# Altium project nPOC-BB_beta_main-board.PrjPcb (part 2 of 4)

## Sheet Battery and Charging.SchDoc: Battery and Charging
size 431 x 279 mm; DrawnBy: DD; DocumentNumber: GHL-1-21002; Revision: B; SheetNumber: 4; SheetTotal: 7; ProjectID: 263-03
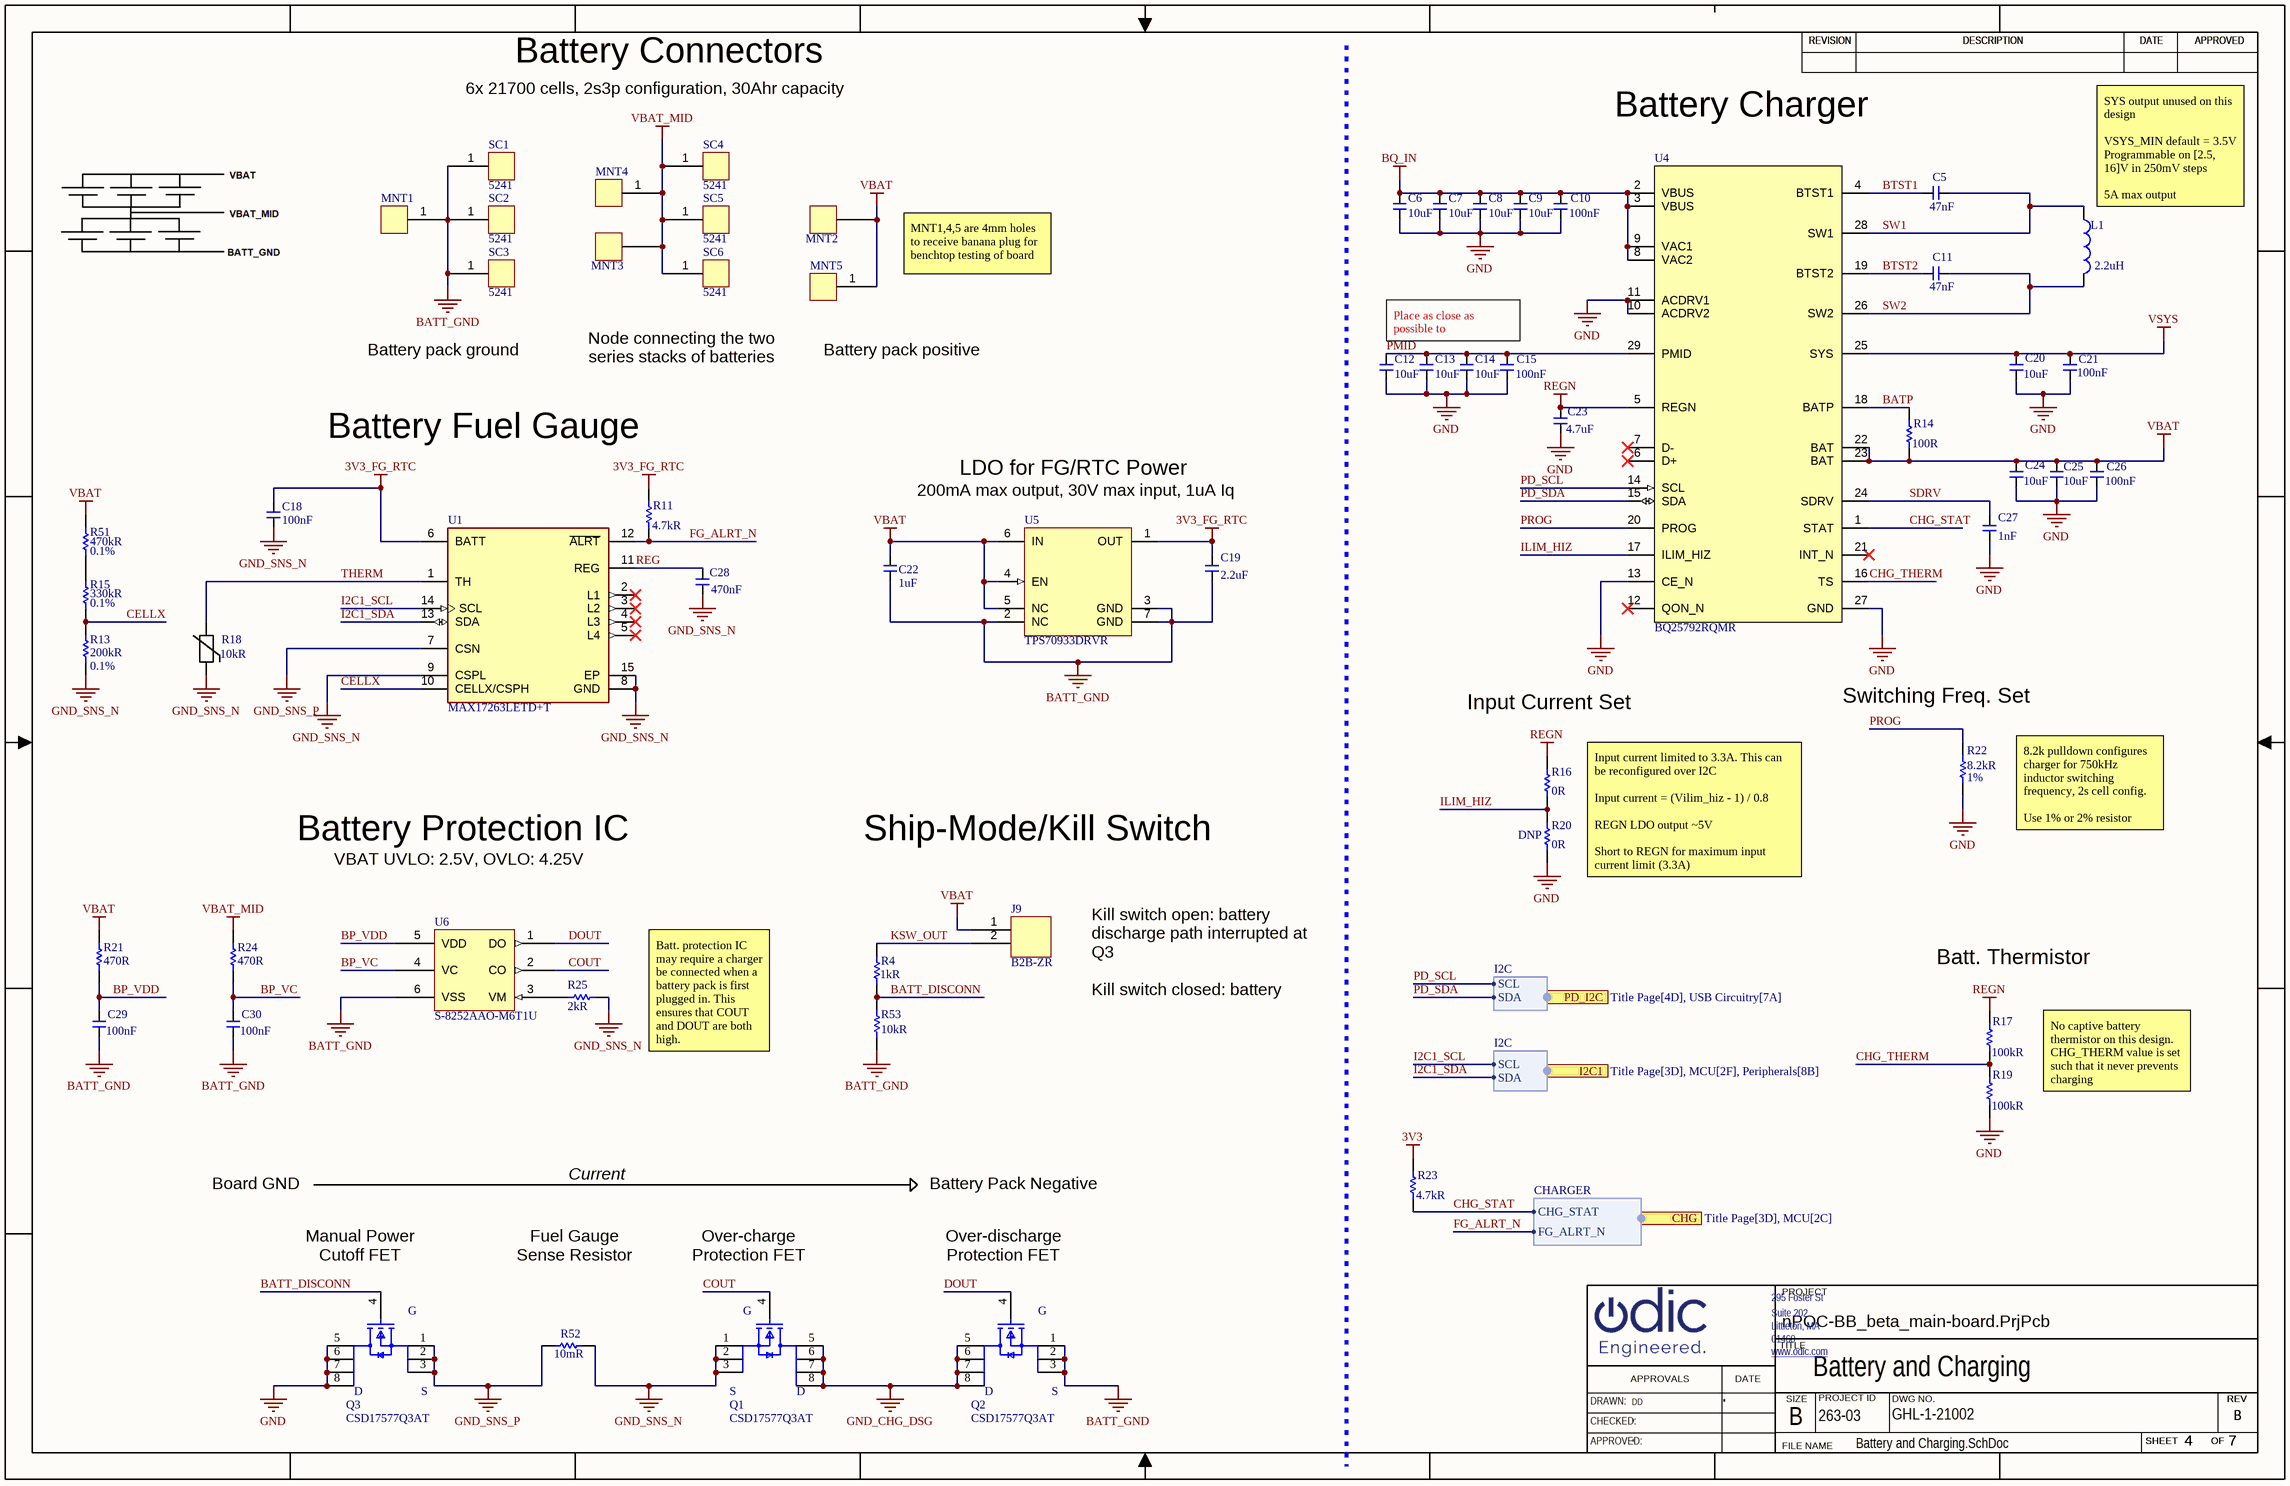
[diagram p3: Battery and Charging.SchDoc]

### Parts
C5  Capacitance: 47nF  [C0402]  (hidden comment: C0402_47n_50V_10pct)
C6  Capacitance: 10uF  [C0603]  (hidden comment: C0603_10u_25V_10pct)
C7  Capacitance: 10uF  [C0603]  (hidden comment: C0603_10u_25V_10pct)
C8  Capacitance: 10uF  [C0603]  (hidden comment: C0603_10u_25V_10pct)
C9  Capacitance: 10uF  [C0603]  (hidden comment: C0603_10u_25V_10pct)
C10  Capacitance: 100nF  [C0402]  (hidden comment: C0402_0u1_25V_10pct)
C11  Capacitance: 47nF  [C0402]  (hidden comment: C0402_47n_50V_10pct)
C12  Capacitance: 10uF  [C0603]  (hidden comment: C0603_10u_25V_10pct)
C13  Capacitance: 10uF  [C0603]  (hidden comment: C0603_10u_25V_10pct)
C14  Capacitance: 10uF  [C0603]  (hidden comment: C0603_10u_25V_10pct)
C15  Capacitance: 100nF  [C0402]  (hidden comment: C0402_0u1_25V_10pct)
C18  Capacitance: 100nF  [C0402]  (hidden comment: C0402_100n_16V_10pct)
C19  Capacitance: 2.2uF  [C0402]  (hidden comment: C0402_2u2_6V3_10pct)
C20  Capacitance: 10uF  [C0603]  (hidden comment: C0603_10u_25V_10pct)
C21  Capacitance: 100nF  [C0402]  (hidden comment: C0402_0u1_25V_10pct)
C22  1uF  [C0402]
C23  Capacitance: 4.7uF  [C0402]  (hidden comment: C0402_4u7_10V_20pct)
C24  Capacitance: 10uF  [C0603]  (hidden comment: C0603_10u_25V_10pct)
C25  Capacitance: 10uF  [C0603]  (hidden comment: C0603_10u_25V_10pct)
C26  Capacitance: 100nF  [C0402]  (hidden comment: C0402_0u1_25V_10pct)
C27  Capacitance: 1nF  [C0402]  (hidden comment: C0402_1n_50V_10pct)
C28  Capacitance: 470nF  [C0402]  (hidden comment: C0402_470n_6V3_10pct)
C29  value 100nF  [C0402]  (hidden comment: C0402_0u1_16V_10pct)
C30  value 100nF  [C0402]  (hidden comment: C0402_0u1_16V_10pct)
J9  B2B-ZR  [jst-b2b-zr]
L1  value 2.2uH  [ind2_5p4x5p2mm]  (hidden comment: 0530CDMCCDS-2R2MC)
MNT1  Banana Plug Hole  [conn_wire-1_4mm]  (value not drawn)
MNT2  SOLDER HOLE 10AWG  [conn_wire-1]  (value not drawn)
MNT3  SOLDER HOLE 10AWG  [conn_wire-1]  (value not drawn)
MNT4  Banana Plug Hole  [conn_wire-1_4mm]  (value not drawn)
MNT5  Banana Plug Hole  [conn_wire-1_4mm]  (value not drawn)
Q1  CSD17577Q3AT  [dfn8_3p1x3p25_p65mm]
Q2  CSD17577Q3AT  [dfn8_3p1x3p25_p65mm]
Q3  CSD17577Q3AT  [dfn8_3p1x3p25_p65mm]
R4  Resistance: 1kR  [R0402]  (hidden comment: R0402_1k0_1pct)
R11  Resistance: 4.7kR  [R0402]  (hidden comment: R0402_4k7_1pct)
R13  value 200kR  Tolerance: 0.1%  [R0402]  (hidden comment: R0402_200k_0.1pct)
R14  value 100R  [R0402]  (hidden comment: R0402_100R_1pct)
R15  value 330kR  Tolerance: 0.1%  [R0402]  (hidden comment: R0402_330k_0p1pct)
R16  Resistance: 0R  [R0402]  (hidden comment: R0402_0R)
R17  Resistance: 100kR  [R0402]  (hidden comment: R0402_100k_1pct)
R18  value 10kR  [R0603]  (hidden comment: NCU18XH103F6SRB)
R19  Resistance: 100kR  [R0402]  (hidden comment: R0402_100k_1pct)
R20  Install: DNP  Resistance: 0R  [R0402]  (hidden comment: R0402_0R)
R21  Resistance: 470R  [R0402]  (hidden comment: R0402_470R_1pct)
R22  value 8.2kR  Resistance Tolerance: 1%  [R0402]  (hidden comment: R0402_8k2_1pct)
R23  Resistance: 4.7kR  [R0402]  (hidden comment: R0402_4k7_1pct)
R24  Resistance: 470R  [R0402]  (hidden comment: R0402_470R_1pct)
R25  Resistance: 2kR  [R0402]  (hidden comment: R0402_2k_1pct)
R51  value 470kR  Tolerance: 0.1%  [R0402]  (hidden comment: R0402_470k_0p1pct)
R52  value 10mR  [R2010]  (hidden comment: R0402_10m_1pct)
R53  Resistance: 10kR  [R0402]  (hidden comment: R0402_10k_1pct)
SC1  5241  [bat_keystone-5241]
SC2  5241  [bat_keystone-5241]
SC3  5241  [bat_keystone-5241]
SC4  5241  [bat_keystone-5241]
SC5  5241  [bat_keystone-5241]
SC6  5241  [bat_keystone-5241]
U1  MAX17263LETD+T  [dfn14_3x3_p4mm]
U4  BQ25792RQMR  [qfn29_4x4_p4mm-RQM0029A]
U5  TPS70933DRVR  [dfn7_2x2_p65mm]
U6  S-8252AAO-M6T1U  [SOT23-6PIN]

### Ports
CHG (harness CHARGER, see Title Page[3D], MCU[2C]), I2C1 (harness I2C, see Title Page[3D], MCU[2F], Peripherals[8B]), PD_I2C (harness I2C, see Title Page[4D], USB Circuitry[7A])

### Harnesses
CHARGER: CHG_STAT, FG_ALRT_N
I2C: SCL, SDA

### Nets
3V3: R23.2
3V3_FG_RTC: C18.1 C19.2 R11.2 U1.6(BATT) U5.1(OUT)
BATT_GND: C19.1 C22.1 C29.1 C30.1 MNT1.1 Q2.1(S) Q2.2(S) Q2.3(S) R53.1 SC1.1 SC2.1 SC3.1 U5.2(NC) U5.3(GND) U5.7(GND) U6.6(VSS)
BQ_IN: C6.2 C7.2 C8.2 C9.2 C10.2 U4.2(VBUS) U4.3(VBUS) U4.8(VAC2) U4.9(VAC1)
GND: C6.1 C7.1 C8.1 C9.1 C10.1 C12.1 C13.1 C14.1 C15.1 C20.1 C21.1 C23.1 C24.1 C25.1 C26.1 C27.1 Q3.5(D) Q3.6(D) Q3.7(D) Q3.8(D) R19.1 R20.1 R22.1 U4.10(ACDRV2) U4.11(ACDRV1) U4.13(CE_N) U4.27(GND)
GND_CHG_DSG: Q1.5(D) Q1.6(D) Q1.7(D) Q1.8(D) Q2.5(D) Q2.6(D) Q2.7(D) Q2.8(D)
GND_SNS_N: C18.2 C28.1 Q1.1(S) Q1.2(S) Q1.3(S) R13.2 R18.1 R25.2 R52.2 U1.8(GND) U1.9(CSPL) U1.15(EP)
GND_SNS_P: Q3.1(S) Q3.2(S) Q3.3(S) R52.1 U1.7(CSN)
REGN: C23.2 R16.2 R17.2 U4.5(REGN)
VBAT: C22.2 C24.2 C25.2 C26.2 J9.1 MNT2.1 MNT5.1 R14.1 R21.1 R51.2 U4.22(BAT) U4.23(BAT) U5.4(EN) U5.5(NC) U5.6(IN)
VBAT_MID: MNT3.1 MNT4.1 R24.1 SC4.1 SC5.1 SC6.1
VSYS: C20.2 C21.2 U4.25(SYS)
BATP: R14.2 U4.18(BATP)
BATT_DISCONN: Q3.4(G) R4.1 R53.2
BP_VC: C30.2 R24.2 U6.4(VC)
BP_VDD: C29.2 R21.2 U6.5(VDD)
BTST1: C5.2 U4.4(BTST1)
BTST2: C11.2 U4.19(BTST2)
CELLX: R13.1 R15.1 U1.10(CELLX/CSPH)
CHG_STAT: R23.1 U4.1(STAT) ; port CHG.CHG_STAT
CHG_THERM: R17.1 R19.2 U4.16(TS)
COUT: Q1.4(G) U6.2(CO)
DOUT: Q2.4(G) U6.1(DO)
FG_ALRT_N: R11.1 U1.12(~{ALRT}) ; port CHG.FG_ALRT_N
I2C1_SCL: U1.14(SCL) ; port I2C1.SCL
I2C1_SDA: U1.13(SDA) ; port I2C1.SDA
ILIM_HIZ: R16.1 R20.2 U4.17(ILIM_HIZ)
KSW_OUT: J9.2 R4.2
PD_SCL: U4.14(SCL) ; port PD_I2C.SCL
PD_SDA: U4.15(SDA) ; port PD_I2C.SDA
PMID: C12.2 C13.2 C14.2 C15.2 U4.29(PMID)
PROG: R22.2 U4.20(PROG)
REG: C28.2 U1.11(REG)
SDRV: C27.2 U4.24(SDRV)
SW1: C5.1 L1.1 U4.28(SW1)
SW2: C11.1 L1.2 U4.26(SW2)
THERM: R18.2 U1.1(TH)
NetR15_2: R15.2 R51.1
NetR25_1: R25.1 U6.3(VM)

Not connected (* = marked no-connect by the designer): U1 2(L1)* 3(L2)* 4(L3)* 5(L4)*; U4 6(D+)* 7(D-)* 12(QON_N)* 21(INT_N)*

### Notes on the sheet
- 6x 21700 cells, 2s3p configuration, 30Ahr capacity
- Battery Connectors
- Battery Charger
- (near L1) SYS output unused on this design
  VSYS_MIN default = 3.5V
  Programmable on [2.5, 16]V in 250mV steps
  5A max output
- MNT1,4,5 are 4mm holes to receive banana plug for benchtop testing of board
- Battery pack ground
- Battery pack positive
- Place as close as possible to @{"Id":"YOCTAYNB\BVPNZYDK","ObjectType":2} pin 29
- Node connecting the two series stacks of batteries
- Battery Fuel Gauge
- 200mA max output, 30V max input, 1uA Iq
- LDO for FG/RTC Power
- (near R22) Switching Freq. Set
- Input Current Set
- 8.2k pulldown configures charger for 750kHz inductor switching frequency, 2s cell config.
  Use 1% or 2% resistor
- Battery Protection IC
- VBAT UVLO: 2.5V, OVLO: 4.25V
- Ship-Mode/Kill Switch
- Input current limited to 3.3A. This can be reconfigured over I2C
  Input current = (Vilim_hiz - 1) / 0.8
  REGN LDO output ~5V
  Short to REGN for maximum input current limit (3.3A)
- Batt. Thermistor
- Kill switch open: battery discharge path interrupted at Q3
  Kill switch closed: battery discharge path uninterrupted
- Batt. protection IC may require a charger be connected when a battery pack is first plugged in. This ensures that COUT and DOUT are both high.
- No captive battery thermistor on this design. CHG_THERM value is set such that it never prevents charging
- Board GND
- Current
- Battery Pack Negative
- Manual Power
  Cutoff FET
- Fuel Gauge
  Sense Resistor
- Over-charge
  Protection FET
- Over-discharge
  Protection FET
- REVISION
- DESCRIPTION
- DATE
- APPROVED
- 295 Foster St
- PROJECT
- www.odic.com <http://www.odic.com>
- Littleton, MA
- 01460
- Suite 202
- TITLE
- DRAWN:
- CHECKED:
- APPROVALS
- SIZE
- B
- PROJECT ID
- DWG NO.
- SHEET
- OF
- REV
- APPROVED:
- FILE NAME

### Library data of the parts
C5 C11 = CMP-00644-3: CGA2B3X7R1H473K050BB; Voltage Rating (DC): 50V; Tolerance: 10%; Dielectric: X7R; Install: POP; Weight: 2.3E-05oz; Case Code (Metric): 1005; Min Operating Temperature: -55°C; Width: 0.02inch; RoHS Compliant: Yes; Thickness: 0.022inch; Ratings: AEC-Q200; Case/Package: 0402; Reach SVHC Compliant: No; Lead Free: Lead Free; Construction: Flat; Mount: Surface Mount; Depth: 0.5mm; Max Operating Temperature: 125°C; Voltage Rating: 50V; Packaging: Tape and Reel; Package Quantity: 1; Series: CGA; Termination: SMD/SMT; Height: 0.5mm; Length: 1mm; Case Code (Imperial): 0402
C6-C9 C12-C14 C20 C24 C25 = CMP-00643-2: GRM188R61E106KA73J; Tolerance: 10%; Voltage Rating: 25V; Install: POP; Case/Package: 0603; RoHS Compliant: Yes; Mount: Surface Mount; Max Operating Temperature: 85°C; Min Operating Temperature: -55°C; Series: GRM
C10 C15 C21 C26 = CMP-00369-1: Cap Ceramic 0.1uF 25V X5R 10% Pad SMD 0402 Multi Layer Ceramic Capacitor (MLCC); Install: POP; Packaging: Tape and Reel; Construction: Flat; Max Operating Temperature: 85°C; Case Code (Metric): 1005; Voltage Rating (DC): 25V; Min Operating Temperature: -55°C; Height: 0.5mm; Series: CL; Case/Package: 0402; Voltage: 25V; Package Quantity: 1; Radiation Hardening: No; Depth: 0.5mm; Thickness: 0.022inch; Lead Free: Lead Free; Tolerance: 10%; Length: 1mm; Mount: Surface Mount; Width: 0.02inch; Dielectric: X5R; RoHS Compliant: Yes; Voltage Rating: 25V; Case Code (Imperial): 0402
C18 = CMP-00301-3: 0.1 µF ±10% 16V Ceramic Capacitor X7R 0402 (1005 Metric); Install: POP; Voltage: 16V; Voltage Rating (DC): 16V; Case/Package: 0402; RoHS Compliant: Yes; Dielectric Material: Ceramic; Package Quantity: 1; Dielectric: X7R; Termination: SMD/SMT; Depth: 0.5mm; Radiation Hardening: No; Construction: Flat; Tolerance: 10%; Case Code (Imperial): 0402; Voltage Rating: 16V; Max Operating Temperature: 125°C; Length: 1mm; Lead Free: Lead Free; REACH SVHC: No SVHC; Packaging: Tape and Reel; Mount: Surface Mount,PCB; Series: -; Case Code (Metric): 1005; Min Operating Temperature: -55°C; Width: 0.02inch; Thickness: 0.022inch; Height: 0.56mm; Contact Plating: Tin,Matte
C19 = CMP-00315-2: CAP CER 2.2UF 6.3V X5R 0402; Tolerance: 10%; Install: POP; Voltage Rating (DC): 6.3V; Resistor Type: Ceramic; Packaging: Tape and Reel; Width: 0.02inch; Depth: 0.5mm; Min Operating Temperature: -55°C; Height: 0.5mm; Dielectric: X5R; RoHS Compliant: Yes; Case Code (Metric): 1005; Case/Package: 0402; Mount: Surface Mount; Lead Free: Lead Free; Series: CL; Max Operating Temperature: 85°C; Termination: SMD/SMT; Length: 1mm; Radiation Hardening: No; Construction: Flat; Thickness: 0.022inch; Case Code (Imperial): 0402; Voltage Rating: 6.3V; Package Quantity: 1
C22 = CMP-00317-1: CAP CER 1UF 16V X5R 0402; Install: POP; Tolerance: 10%; Thickness: 0.022inch; Radiation Hardening: No; Voltage Rating: 16V; Length: 1mm; Voltage: 16V; Capacitance: 1uF; Dielectric: X5R; Packaging: Tape and Reel; Contact Plating: Tin; Min Operating Temperature: -55°C; Series: CL; Depth: 0.5mm; Case Code (Imperial): 0402; Case Code (Metric): 1005; Package Quantity: 1; RoHS Compliant: Yes; Height: 0.5mm; Mount: Surface Mount; Max Operating Temperature: 85°C; Case/Package: 0402; Width: 0.02inch; Construction: Flat
C23 = CMP-00316-1: Cap Ceramic 4.7uF 10V X5R 20% SMD 0402 85°C Paper T/R; Install: POP; Width: 0.02inch; Package Quantity: 10000; Min Operating Temperature: -55°C; Mount: Surface Mount; Case Code (Imperial): 0402; Case/Package: 0402; Series: CL; Packaging: Cut Tape; Length: 0.039inch; Dielectric: X5R; Voltage Rating: 10V; Thickness: 0.022inch; Tolerance: 20%; Max Operating Temperature: 85°C; RoHS Compliant: Yes; Case Code (Metric): 1005; Lead Free: Lead Free
C27 = CMP-00366-1: 0402 1 nF 50V ±10 % Tolerance X7R Surface Mount Multilayer Ceramic Capacitor; Dissipation Factor: 2.5%; Install: POP; Tolerance: 10%; Insulation Resistance: 100GR; RoHS Compliant: Yes; Termination: SMD/SMT; Radiation Hardening: No; Length: 1mm; Contact Plating: Tin,Matte; Voltage Rating (DC): 50V; Thickness: 0.022inch; Case/Package: 0402; Height: 0.56mm; Mount: Surface Mount; Series: -; Construction: Flat; Lead Free: Lead Free; Case Code (Metric): 1005; Reach SVHC Compliant: Yes; Max Operating Temperature: 125°C; Width: 0.02inch; Depth: 0.5mm; Packaging: Tape and Reel; Number of Pins: 2; Voltage: 50V; Package Quantity: 1; Min Operating Temperature: -55°C; Dielectric: X7R; Voltage Rating: 50V; Case Code (Imperial): 0402
C28 = CMP-00343-1: Ceramic capacitor SMD-0402 470nF /6, 3V X5R# K +-10%, Samsung, RoHS; Dielectric: X5R; Voltage Rating: 6.3V; Install: POP; Tolerance: 10%; Height: 0.5mm; Case/Package: 0402; Contact Plating: Tin; Series: CL; Voltage Rating (DC): 6.3V; Lead Free: Lead Free; Mount: Surface Mount; Width: 0.02inch; Length: 1mm; Voltage: 6.3V; Thickness: 0.022inch; Package Quantity: 1; Case Code (Metric): 1005; Packaging: Tape and Reel; Radiation Hardening: No; Min Operating Temperature: -55°C; Depth: 0.5mm; Case Code (Imperial): 0402; RoHS Compliant: Yes; Construction: Flat; Max Operating Temperature: 85°C
C29 C30 = CMP-00446-1: Ceramic capacitor SMD 0402 100nF 16V X7R 10%; Install: POP; Voltage: 16V; Mounting Technology: Surface Mount; Width: 0.02inch; Case Code (Metric): 1005; Package Quantity: 1; Depth: 0.5mm; RoHS Compliant: Yes; Length: 1mm; Tolerance: 10%; Radiation Hardening: No; Contact Plating: Tin; Packaging: Tape and Reel; Voltage Rating (DC): 16V; Thickness: 0.022inch; Case Code (Imperial): 0402; Case/Package: 0402; Min Operating Temperature: -55°C; Max Operating Temperature: 125°C; Voltage Rating: 16V; Height: 0.5mm; Series: CL; Material: Ceramic; Construction: Flat; Lead Free: Lead Free; Dielectric: X7R
J9 = CMP-00969-2: Board Connector, 2 Contact(s), 1 Row(s), Male, Straight, Solder Terminal; Insulation Resistance: 500MR; Current Rating: 1A; Test Voltage: 500V; Contact Resistance: 20mR; Number of Contacts: 2; Pitch: 0.059inch; Number of Rows: 1; Termination: Press-Fit; Fastening Type: Detent; Housing Material: Nylon; Contact Material: Bronze,Tin; Contact Mating Length: 0.094inch; Lead Free: Contains Lead; Contact Plating: Tin,Lead; Package Quantity: 2000; Contact Type: Male Pin; Gender: Male; Mounting Technology: Through Hole; Packaging: Bulk; Series: ZH; Number of Positions: 2; Color: Natural; Orientation: Vertical; Housing Color: Natural
L1 = CMP-00675-2: FIXED IND 2.2UH 5.8A 29 MOHM; Shielding: Shielded; Install: POP; Saturation Current: 9A; Tolerance: 20%; Core Material: Metal; DC Resistance (DCR): 29mR; Test Frequency: 100kHz; Length: 0.205inch; RoHS Compliant: Yes; Min Operating Temperature: -55°C; Case/Package: Nonstandard; Packaging: Tape and Reel; Series: 0530CDMC/DS; Max Operating Temperature: 125°C; Current Rating: 5.8A; Width: 0.205inch; Height - Seated (Max): 0.118inch; Mounting Technology: Surface Mount
MNT1 MNT4 MNT5 = CMP-00998-2: 4mm hole to accept banana plug
MNT2 MNT3 = CMP-001-0010-3: Hole for 10AWG solder connection
Q1-Q3 = CMP-00688-4: 30-V, N channel NexFET™ power MOSFET, single SON 3 mm x 3 mm, 6.4 mOhm 8-VSONP -55 to 150; Drain to Source Resistance: 5.3mR; Power Dissipation: 2.8W; Threshold Voltage: 1.4V; Drain to Source Breakdown Voltage: 30V; Max Power Dissipation: 53W; Turn-Off Delay Time: 20ns; Number of Channels: 1; Gate to Source Voltage (Vgs): 20V; Rds On Max: 4.8mR; Fall Time: 4ns; Input Capacitance: 2.31nF; Polarity: N-CHANNEL; Continuous Drain Current (ID): 19A; Rise Time: 31ns; Install: POP; Case/Package: VSON; Pins: 8; Max Operating Temperature: 150°C; Series: NexFET™; Lead Free: Lead Free; Min Operating Temperature: -55°C; Element Configuration: Single; Reach SVHC Compliant: No; RoHS Compliant: Yes; Packaging: Tape and Reel; Number of Elements: 1; Mounting Technology: Surface Mount; Turn-On Delay Time: 4ns; Contact Plating: Tin; Drain to Source Voltage (Vdss): 30V; Package Quantity: 250
R4 = CMP-00307-2: Surface Mount Chip Resistor, Thick Film, RC Series, 1 kohm, 62.5 mW, 1%, 50 V, 0402 [1005 Metric]; Voltage Rating (DC): 50V; Install: POP; Temperature Coefficient: 100ppm/°C; Power Rating: 62.5mW; Max Power Dissipation: 63mW; Length: 1mm; Resistance Tolerance: 1%; Lead Free: Lead Free; Size Code: 0402; Technology: THICK FILM; Case/Package: 0402; RoHS Compliant: Yes; Series: RC; Number of Pins: 2; Height: 0.32mm; Tolerance: 1%; Resistor Type: Thick Film; Military Standard: Not; Termination: SMD/SMT; Voltage Rating: 50V; Construction: Rectangular; Packaging: Tape and Reel; Depth: 0.5mm; Features: Moisture Resistant; REACH SVHC: No SVHC; Width: 0.5mm; Min Operating Temperature: -55°C; Max Operating Temperature: 155°C; Number of Terminations: 2; Case Code (Metric): 1005; Case Code (Imperial): 0402
R11 R23 = CMP-00336-2: RES 4.7K OHM 1% 1/16W 0402; Install: POP; Temperature Coefficient: 100ppm/°C; Voltage Rating: 50V; Max Power Dissipation: 63mW; Power Rating: 62.5mW; Features: Moisture Resistant; Length: 1mm; REACH SVHC: No SVHC; RoHS Compliant: Yes; Military Standard: Not; Size Code: 0402; Series: RC; Width: 0.5mm; Lead Free: Lead Free; Max Operating Temperature: 155°C; Height: 0.32mm; Voltage Rating (DC): 50V; Construction: Rectangular; Packaging: Tape and Reel; Tolerance: 1%; Case Code (Metric): 1005; Case Code (Imperial): 0402; Number of Pins: 2; Resistor Type: Thick Film; Number of Terminations: 2; Termination: SMD/SMT; Min Operating Temperature: -55°C; Case/Package: 0402; Height - Seated (Max): 0.016inch; Resistance Tolerance: 1%; Depth: 0.5mm
R13 = CMP-00991-1: SMD Chip Resistor, 200 kOhm, ± 0.1%, 63 mW, 0402 [1005 Metric], Thin Film, Precision; Operating Supply Voltage: 25V; Number of Resistors: 1; Temperature Coefficient: 25ppm/°C; Power Rating: 63mW; Military Standard: Not; Package Quantity: 1000; Termination: Solder; Width: 0.5mm; Case Code (Metric): 1005; Depth: 500um; Weight: 2.3E-05oz; Mounting Technology: Surface Mount; RoHS Compliant: Yes; Radiation Hardening: No; Number of Terminations: 2; Voltage Rating (DC): 25V; Height: 0.3mm; Series: CPF; Length: 1mm; Resistor Type: Thin Film; Case Code (Imperial): 0402; Packaging: Tape and Reel; Voltage Rating: 25V; Max Operating Temperature: 155°C; Lead Free: Lead Free; ELV: Compliant; Contact Plating: Tin; Case/Package: 0402; Resistance Tolerance: 0.1%; Reach SVHC Compliant: No; Max Power Dissipation: 63mW; Min Operating Temperature: -55°C
R14 = CMP-009-00016-1: Res General Purpose Thick Film 0402 100 Ohm 1% 1/16W ±200ppm/°C Molded SMD Paper T/R; Voltage Rating (DC): 50V; Power Rating: 62.5mW; Install: POP; Max Power Dissipation: 63mW; Temperature Coefficient: 100ppm/°C; Reach SVHC Compliant: No; Construction: Rectangular; Case/Package: 0402; Military Standard: Not; Lead Free: Lead Free; Number of Terminations: 2; Case Code (Metric): 1005; Pins: 2; Width: 0.5mm; Features: Moisture Resistant; Tolerance: 1%; Packaging: Tape and Reel; Depth: 0.5mm; Technology: THICK FILM; Series: RC; Min Operating Temperature: -55°C; Height: 0.32mm; RoHS Compliant: Yes; Max Operating Temperature: 155°C; Voltage Rating: 50V; Case Code (Imperial): 0402; Resistance Tolerance: 1%; Termination: SMD/SMT; Resistor Type: Thick Film; Length: 1mm
R15 = CMP-01000-1: Res, 330K, 0.1W, 0402, Thin Film Rohs Compliant: Yes; Package: 0402
R16 = CMP-00319-1: RES 0 OHM JUMPER 1/16W 0402; Max Power Dissipation: 63mW; Install: POP; Working Voltage: 50V; Current Rating: 1A; Case/Package: 0402; Max Operating Temperature: 155°C; Contact Plating: Tin,Matte; Height: 0.016inch; RoHS Compliant: Yes; Lead Free: Lead Free; Length: 0.039inch; Case Code (Imperial): 0402; Resistor Type: Thick Film; Military Standard: Not; Width: 0.02inch; Construction: Rectangular; Features: Automotive AEC-Q200; Depth: 0.5mm; Case Code (Metric): 1005; Technology: THICK FILM; Number of Terminations: 2; Power Rating: 63mW; Radiation Hardening: No; Min Operating Temperature: -55°C; Series: RMCF; Packaging: Tape and Reel; Mount: Surface Mount
R17 R19 = CMP-00351-1: Res General Purpose Thick Film 0402 100K Ohm 1% 1/16W ±100ppm/°C Molded SMD Paper T/R; Working Voltage: 50V; Install: POP; Power Rating: 63mW; Series: RC; Military Standard: Not; Case Code (Metric): 1005; Features: Moisture Resistant; Termination: SMD/SMT; Number of Terminations: 2; Temperature Coefficient: 100ppm/°C; Height: 0.016inch; Tolerance: 1%; Case/Package: 0402; Depth: 0.5mm; RoHS Compliant: Yes; Resistance Tolerance: 1%; Lead Free: Lead Free; Max Operating Temperature: 155°C; Min Operating Temperature: -55°C; Width: 0.02inch; Packaging: Tape and Reel; Technology: THICK FILM; Case Code (Imperial): 0402; Package Quantity: 1; REACH SVHC: No SVHC; Resistor Type: Thick Film; Max Power Dissipation: 63mW; Voltage Rating: 50V; Length: 0.039inch; Construction: Rectangular
R18 = CMP-00365-2: NTC Thermistor 10k 0603 (1608 Metric); Max Power Dissipation: 100mW; Install: POP; Resistance Tolerance: 1%; Reach SVHC Compliant: Yes; Min Operating Temperature: -40°C; Case Code (Imperial): 0603; Series: NCU; Max Operating Temperature: 125°C; Case/Package: 0603; RoHS Compliant: Yes; Case Code (Metric): 1608
R20 = CMP-00319-1: RES 0 OHM JUMPER 1/16W 0402; Max Power Dissipation: 63mW; Working Voltage: 50V; Current Rating: 1A; Case/Package: 0402; Max Operating Temperature: 155°C; Contact Plating: Tin,Matte; Height: 0.016inch; RoHS Compliant: Yes; Lead Free: Lead Free; Length: 0.039inch; Case Code (Imperial): 0402; Resistor Type: Thick Film; Military Standard: Not; Width: 0.02inch; Construction: Rectangular; Features: Automotive AEC-Q200; Depth: 0.5mm; Case Code (Metric): 1005; Technology: THICK FILM; Number of Terminations: 2; Power Rating: 63mW; Radiation Hardening: No; Min Operating Temperature: -55°C; Series: RMCF; Packaging: Tape and Reel; Mount: Surface Mount
R21 R24 = CMP-00335-2: Res Thick Film 0402 470 Ohm 1% 0.063W(1/16W) ±100ppm/C Pad SMD T/R; Install: POP; Max Power Dissipation: 63mW; Voltage Rating: 50V; Temperature Coefficient: 100ppm/°C; Power Rating: 62.5mW; Max Operating Temperature: 155°C; Length: 1mm; Features: Moisture Resistant; Height: 0.016inch; Packaging: Tape and Reel; Lead Free: Lead Free; Min Operating Temperature: -55°C; Series: RC; Depth: 0.5mm; Size Code: 0402; Number of Terminations: 2; REACH SVHC: No SVHC; Resistor Type: Thick Film; Package Quantity: 1; Case Code (Metric): 1005; Width: 0.02inch; RoHS Compliant: Yes; Termination: SMD/SMT; Case Code (Imperial): 0402; Resistance Tolerance: 1%; Tolerance: 1%; Military Standard: Not; Case/Package: 0402; Construction: Rectangular
R22 = CMP-00977-1: SMD Chip Resistor, 8.2 kOhm, ± 1%, 62.5 mW, 0402 [1005 Metric], Thick Film, General Purpose; Voltage Rating (AC): 50V; Temperature Coefficient: 100ppm/°C; Max Power Dissipation: 63mW; Features: Moisture Resistant; Lead Free: Lead Free; Case Code (Imperial): 0402; Min Operating Temperature: -55°C; Reach SVHC Compliant: Unknown; Construction: Rectangular; Number of Terminations: 2; RoHS Compliant: Yes; Weight: 2.3E-05oz; Package Quantity: 1; Max Operating Temperature: 155°C; Length: 1mm; Termination: SMD/SMT; Voltage Rating: 50V; Military Standard: Not; Depth: 0.5mm; Case Code (Metric): 1005; Resistor Type: Thick Film; Case/Package: 0402; Technology: THICK FILM; Tolerance: 1%; Packaging: Tape and Reel; Width: 0.02inch; Power Rating: 63mW; Series: RC; Working Voltage: 50V; Height: 0.016inch
R25 = CMP-00390-1: Res General Purpose Thick Film 0402 2K Ohm 1% 1/16W ±100ppm/°C Molded SMD Paper T/R; Voltage Rating (DC): 50V; Power Rating: 63mW; Install: POP; Case/Package: 0402; Lead Free: Lead Free; Min Operating Temperature: -55°C; Number of Terminations: 2; Termination: SMD/SMT; Resistor Type: Thick Film; Case Code (Metric): 1005; Temperature Coefficient: 100ppm/°C; Width: 0.02inch; Depth: 0.5mm; Case Code (Imperial): 0402; RoHS Compliant: Yes; Working Voltage: 50V; Max Power Dissipation: 63mW; Military Standard: Not; Series: RC; Height: 0.016inch; Construction: Rectangular; Packaging: Tape and Reel; Length: 0.039inch; Tolerance: 1%; Resistance Tolerance: 1%; Technology: THICK FILM; Max Operating Temperature: 155°C; Package Quantity: 1; Features: Moisture Resistant; Voltage Rating: 50V
R51 = CMP-00999-1: 470 kOhms 0.1% 0.063W, 1/16W Chip Resistor 0402 (1005 Metric) Anti-Sulfur, Autom; Package: 0402
R52 = CMP-00996-1: Res Current Sense Metal Strip 2010 0.01 Ohm 1% 2W ±75ppm/°C Molded Emboss T/R; Power Rating: 2W
R53 = CMP-00352-1: Res Thick Film 0402 10K Ohm 1% 1/16W ±100ppm/°C Molded SMD SMD T/R; Max Power Dissipation: 63mW; Install: POP; RoHS Compliant: Yes; Number of Terminations: 2; Case/Package: 0402; Case Code (Metric): 1005; Length: 0.039inch; Military Standard: Not; Size Code: 0402; Series: RC; Height: 0.016inch; Contact Plating: Tin; Features: Moisture Resistant; Width: 0.02inch; Mount: Surface Mount; Temperature Coefficient: 100ppm/°C; Package Quantity: 1; Resistor Type: Thick Film; Min Operating Temperature: -55°C; Max Operating Temperature: 155°C; Power Rating: 63mW; Tolerance: 1%; Depth: 0.5mm; Case Code (Imperial): 0402; Construction: Rectangular; Packaging: Tape and Reel; Radiation Hardening: No
SC1-SC6 = CMP-00992-2: Cylindrical Battery Contacts, Clips, Holders & Springs C Cell Negative Battery Contact; Number of Batteries: 1; Package Quantity: 100; Lead Free: Lead Free; RoHS Compliant: Yes; Contact Plating: Nickel; Material: Steel; Series: -; Reach SVHC Compliant: No
U1 = CMP-00482-3: MAX17263 Series 4.9 V Single/Multi-Cell Ultra-Low Power Fuel-Gauge IC-TDFN-14EP; Install: POP; RoHS Compliant: Yes
U4 = CMP-058-000000-7: I2C Controlled, 1-4 Cell, 5-A Buck-Boost Battery Charger with Dual-Input; Mfr_Name: Texas Instruments; Install: POP; TYPE: TYPE; Source: PQ25792RQMR.SchLib; Design Item ID: BQ25792RQMR; RefDes: RefDes; RoHS Compliant: Yes
U5 = CMP-00988-2: LDO Regulator Positive 3.3V 0.15A 6-Pin SON T/R; Max Supply Voltage: 30V; Number of Outputs: 1; Output Type: Fixed; Min Input Voltage: 2.7V; Min Current Limit: 200mA; Output Current: 150mA; Accuracy: 2%; Dropout Voltage: 960mV; Min Operating Temperature: -40°C; RoHS Compliant: Yes; Radiation Hardening: No; Polarity: Positive; Thickness: 750um; Width: 2mm; Min Supply Voltage: 2.7V; Length: 2mm; Package Quantity: 3000; Mounting Technology: Surface Mount; Output Voltage: 3.3V; Number of Regulators: 1; Series: -; Height: 800um; Case/Package: SON; Pins: 6; Packaging: Tape and Reel; Max Operating Temperature: 125°C; Max Output current: 150mA; Lead Free: Lead Free
U6 = CMP-00995-2: Battery Protection Li-Ion/Li-Pol 6-Pin SOT-23 T/R. 4.25V OVP, 2.5V UVP; RoHS Compliant: Yes